# EAGLE design seguidor LDR_22 (EAGLE 7.2.0)
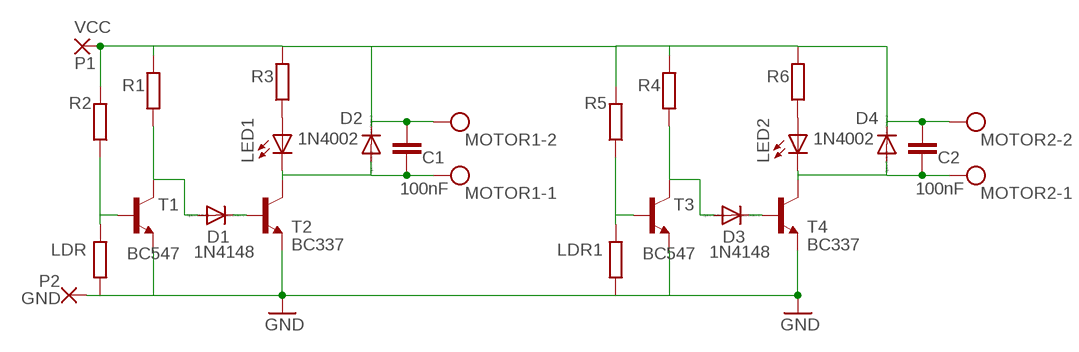
[diagram p0: schematic, sheet 1]

## Parts
C1  100nF  C-EU050-025X075  [C050-025X075]
C2  100nF  C-EU050-025X075  [C050-025X075]
D1  1N4148  1N4148DO35-10  [DO35-10]
D2  1N4002  1N4004  [DO41-10]
D3  1N4148  1N4148DO35-10  [DO35-10]
D4  1N4002  1N4004  [DO41-10]
GND  P2  WIREPAD2,15/1,0  [2,15/1,0]
LDR  R-EU_0204/5  [0204/5]
LDR1  R-EU_0204/5  [0204/5]
LED1  LED3MM  [LED3MM]
LED2  LED3MM  [LED3MM]
MOTOR1  AK500/2  [AK500/2]
MOTOR2  AK500/2  [AK500/2]
R1  R-EU_0207/10  [0207/10]
R2  R-EU_0207/10  [0207/10]
R3  R-EU_0207/10  [0207/10]
R4  R-EU_0207/10  [0207/10]
R5  R-EU_0207/10  [0207/10]
R6  R-EU_0207/10  [0207/10]
T1  BC547  BC337-16-NPN-TO92-CBE  [TO92-CBE]
T2  BC337  BC337-16-NPN-TO92-CBE  [TO92-CBE]
T3  BC547  BC337-16-NPN-TO92-CBE  [TO92-CBE]
T4  BC337  BC337-16-NPN-TO92-CBE  [TO92-CBE]
VCC  P1  WIREPAD2,15/1,0  [2,15/1,0]

## Nets
GND: GND.1(P) LDR1.1 LDR.1 T1.E T2.E T3.E T4.E
N$1: LDR.2 R2.1 T1.B
N$2: C1.1 C2.1 D2.C D4.C MOTOR1.2 MOTOR2.2 R1.2 R2.2 R3.2 R4.2 R5.2 R6.2 VCC.1(P)
N$3: LDR1.2 R5.1 T3.B
N$4: D3.A R4.1 T3.C
N$5: LED1.A R3.1
N$6: D1.A R1.1 T1.C
N$7: D1.C T2.B
N$8: C1.2 D2.A LED1.K(C) MOTOR1.1 T2.C
N$9: D3.C T4.B
N$10: C2.2 D4.A LED2.K(C) MOTOR2.1 T4.C
N$12: LED2.A R6.1

## Library data of the parts
C1 C2 = rcl:C-EU: CAPACITOR, European symbol
D1 D3 = diode:1N4148: DIODE high speed (Philips)
D2 D4 = diode:1N4004: DIODE general purpose rectifier, 1 A
GND VCC = wirepad:WIREPAD: Wire PAD connect wire on PCB
LDR LDR1 R1-R6 = resistor:R-EU_: RESISTOR, European symbol
LED1 LED2 = led:LED: LED OSRAM: - CHIPLED LG R971, LG N971, LY N971, LG Q971, LY Q971, LO R971, LY R971 LH N974, LH R974 LS Q976, LO Q976, LY Q976 LO Q996 - Hyper CHIPLED LW Q18S LB Q993, LB Q99A, LB R99A - SideLED LS A670, LO A670, LY A670, LG A670, LP A670 LB A673, LV A673, LT A673, LW A673 LH A674 LY A675 LS A676, LA A676, LO A676, LY A676, LW A676 LS A679, LY A679, LG A679 - Hyper Micro SIDELED® LS Y876, LA Y876, LO Y876, LY Y876 LT Y87S - SmartLED LW L88C, LW L88S LB L89C, LB L89S, LG L890 LS L89K, LO L89K, LY L89K LS L896, LA L896, LO L896, LY L896 - TOPLED LS T670, LO T670, LY T670, LG T670, LP T670 LSG T670, LSP T670, LSY T670, LOP T670, LYG T670 LG T671, LOG T671, LSG T671 LB T673, LV T673, LT T673, LW T673 LH T674 LS T676, LA T676, LO T676, LY T676, LB T676, LH T676, LSB T676, LW T676 LB T67C, LV T67C, LT T67C, LS T67K, LO T67K, LY T67K, LW E67C LS E67B, LA E67B, LO E67B, LY E67B, LB E67C, LV E67C, LT E67C LW T67C LS T679, LY T679, LG T679 LS T770, LO T770, LY T770, LG T770, LP T770 LB T773, LV T773, LT T773, LW T773 LH T774 LS E675, LA E675, LY E675, LS T675 LS T776, LA T776, LO T776, LY T776, LB T776 LHGB T686 LT T68C, LB T68C - Hyper Mini TOPLED® LB M676 - Mini TOPLED Santana® LG M470 LS M47K, LO M47K, LY M47K Source: http://www.osram.convergy.de LUXEON: - LUMILED® LXK2-PW12-R00, LXK2-PW12-S00, LXK2-PW14-U00, LXK2-PW14-V00 LXK2-PM12-R00, LXK2-PM12-S00, LXK2-PM14-U00 LXK2-PE12-Q00, LXK2-PE12-R00, LXK2-PE12-S00, LXK2-PE14-T00, LXK2-PE14-U00 LXK2-PB12-K00, LXK2-PB12-L00, LXK2-PB12-M00, LXK2-PB14-N00, LXK2-PB14-P00, LXK2-PB14-Q00 LXK2-PR12-L00, LXK2-PR12-M00, LXK2-PR14-Q00, LXK2-PR14-R00 LXK2-PD12-Q00, LXK2-PD12-R00, LXK2-PD12-S00 LXK2-PH12-R00, LXK2-PH12-S00 LXK2-PL12-P00, LXK2-PL12-Q00, LXK2-PL12-R00 Source: www.luxeon.com KINGBRIGHT: KA-3528ASYC Source: www.kingbright.com
MOTOR1 MOTOR2 = con-ptr500:AK500/2: CONNECTOR; OC_FARNELL: unknown; OC_NEWARK: unknown
T1-T4 = transistor:*-NPN-: NPN Transistror BF959 corrected 2008.03.06

## Board
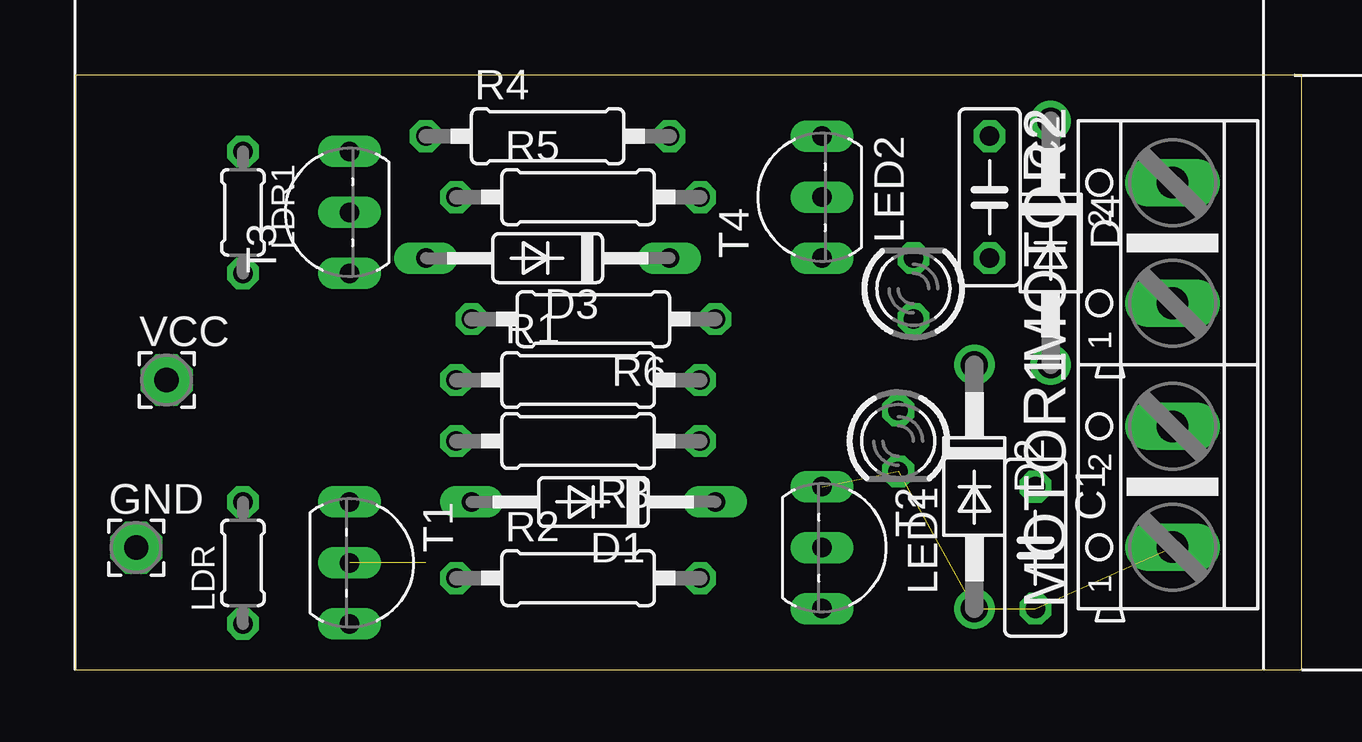
[diagram p1: board, top side]
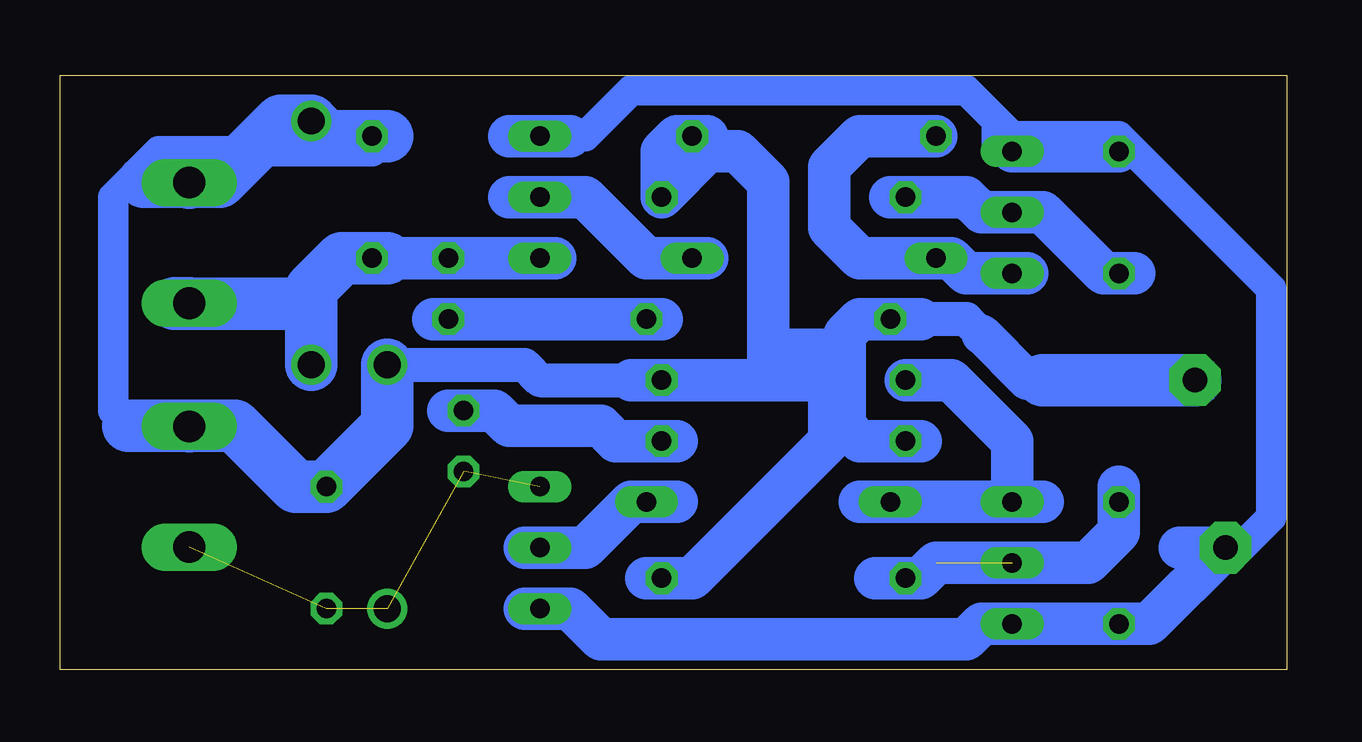
[diagram p2: board, bottom side, seen from below]

Size 51.11 x 24.75 mm. Coordinates in mm from the lower left corner, seen from the top.
Outline: 0,0 51.11,0 51.11,24.75 0,24.75 0,0
Copper layers (1*16): Top 0.035mm / dielectric 1.5mm / Bottom 0.035mm
Design rules "default": minimum track width 10mil, minimum drill 24mil, track to track 8mil, track to pad 8mil, pad to pad 8mil, via to via 8mil, smd to smd 8mil, copper to edge 40mil, drill to drill 8mil, minimum pad ring 10mil, minimum via ring 8mil, stop-mask expansion 4mil, vias tented up to drill 0mil, thermal gap 10mil

### Footprints (pad centres in the part's own frame; a part is rotated, then mirrored left to right if it is on the bottom)
C050-025X075 = drill 0.813 octagon: 1 -2.54,0; 2 2.54,0
DO35-10 = drill 0.813 long: A 5.08,0; C -5.08,0
DO41-10 = drill 1.118: A 5.08,0; C -5.08,0
2,15/1,0 = drill 1.016 pad 2.159 octagon: 1 0,0
0204/5 = drill 0.813 octagon: 1 -2.54,0; 2 2.54,0
LED3MM = drill 0.813 octagon: A -1.27,0; K 1.27,0
AK500/2 = drill 1.321 long: 1 -2.515,0; 2 2.515,0
0207/10 = drill 0.813 octagon: 1 -5.08,0; 2 5.08,0
TO92-CBE = drill 0.813 long: B 0,0; C -2.54,0; E 2.54,0

### Placement (x,y rotation side)
C1  40.01,5.08 270 top
C2  38.1,19.68 270 top
D1  21.59,6.99 180 top
D2  37.47,7.62 270 top
D3  19.69,17.14 180 top
D4  40.64,17.78 270 top
GND  2.54,5.08 0 top
LDR  6.99,4.45 90 top
LDR1  6.99,19.05 270 top
LED1  34.29,9.53 270 top
LED2  34.93,15.88 90 top
MOTOR1  45.72,7.62 90 top
MOTOR2  45.72,17.78 90 top
R1  20.95,12.06 0 top
R2  20.95,3.81 0 top
R3  20.95,9.53 180 top
R4  19.69,22.23 0 top
R5  20.95,19.68 0 top
R6  21.59,14.61 180 top
T1  11.43,4.45 270 top
T2  31.12,5.08 270 top
T3  11.43,19.05 90 top
T4  31.12,19.68 90 top
VCC  3.81,12.06 0 top

### Tracks (layer width: path | path; a pad name or v marks a point on that pad's centre or on a via)
GND
  Bottom 1.27: 29.84,22.23 29.21,22.23 27.3,24.13 13.33,24.13 12.06,22.86 | 12.06,22.86 12.06,21.59 T3.E | GND.1 1.9,5.08 0.63,6.35 0.63,15.88 6.99,22.23 11.43,22.23 12.06,22.86
  Bottom 1.778: T3.E LDR1.1 | 32.38,22.23 T4.E 29.84,22.23 | 31.75,2.54 T2.E 29.84,2.54 28.58,1.27 13.33,1.27 12.7,1.91 T1.E LDR.1 5.71,1.91 GND.1 4.45,5.08
N$1  (1 unrouted)
  Bottom 1.778: 17.15,3.81 R2.1 15.24,3.81 14.6,4.45 8.26,4.45 6.99,5.71 LDR.2 6.99,7.62
N$2
  Bottom 1.27: C2.1 38.1,21.59 46.99,21.59 48.9,19.68 48.9,10.79 48.26,10.16
  Bottom 1.422: D2.C 31.75,12.7 31.12,12.06 27.3,12.06 | 12.7,13.97 13.33,14.61 15.24,14.61
  Bottom 1.676: 10.16,12.06 10.79,12.06 12.7,13.97
  Bottom 1.778: 18.41,12.06 18.41,13.97 17.78,14.61 R6.2 15.24,14.61 | 18.41,12.06 18.41,10.16 17.78,9.53 R3.2 15.24,9.53 | 21.59,12.06 R1.2 27.3,12.06 | 21.59,12.06 20.32,12.06 | 20.32,12.06 18.41,12.06 | 24.13,22.23 R4.2 25.4,22.23 26.04,21.59 R5.2 24.13,21.59 22.86,21.59 21.59,20.32 21.59,12.06 | 26.67,3.81 R2.2 24.77,3.81 19.05,9.53 19.05,13.34 20.95,13.34 20.95,12.7 20.32,12.06
  Bottom 2.184: D2.C 37.47,10.16 C1.1 41.27,7.62 43.82,10.16 45.75,10.16 | 45.75,10.16 MOTOR1.2 | 37.47,22.23 C2.1 40.01,22.23 D4.C 41.91,22.86 44.45,20.32 45.75,20.32 | 47.62,20.32 45.75,20.32 | 45.75,20.32 MOTOR2.2 | 48.26,10.16 45.75,10.16 | VCC.1 10.16,12.06
N$3
  Bottom 1.778: 6.35,16.51 LDR1.2 7.62,16.51 10.16,19.05 T3.B 12.7,19.05 13.33,19.68 R5.1 16.51,19.68
N$4
  Bottom 1.778: R4.1 17.78,22.23 19.05,20.95 19.05,18.41 17.78,17.14 D3.A 13.97,17.14 13.33,16.51 T3.C 10.79,16.51
N$5
  Bottom 1.778: 34.93,10.79 LED1.A 33.02,10.79 32.38,10.16 28.58,10.16 27.94,9.53 R3.1 25.4,9.53
N$6
  Bottom 1.778: R1.1 13.97,12.06 11.43,9.53 T1.C | 17.78,6.99 D1.A T1.C | T1.C 10.16,6.99
N$7
  Bottom 1.778: 25.4,6.99 D1.C 27.3,6.99 29.21,5.08 T2.B 31.75,5.08
N$8  (4 unrouted)
N$9
  Bottom 1.778: 24.13,17.14 D3.C 26.67,17.14 29.21,19.68 T4.B 32.38,19.68
N$10
  Bottom 1.778: C2.2 37.47,17.14 LED2.K T4.C 30.48,17.14
  Bottom 2.184: D4.A 40.64,15.24 | 40.64,15.24 40.64,15.88 39.37,17.14 37.47,17.14 | MOTOR2.1 46.33,15.27 46.36,15.24 40.64,15.24
N$12
  Bottom 1.778: 35.56,14.61 LED2.A R6.1 26.04,14.61